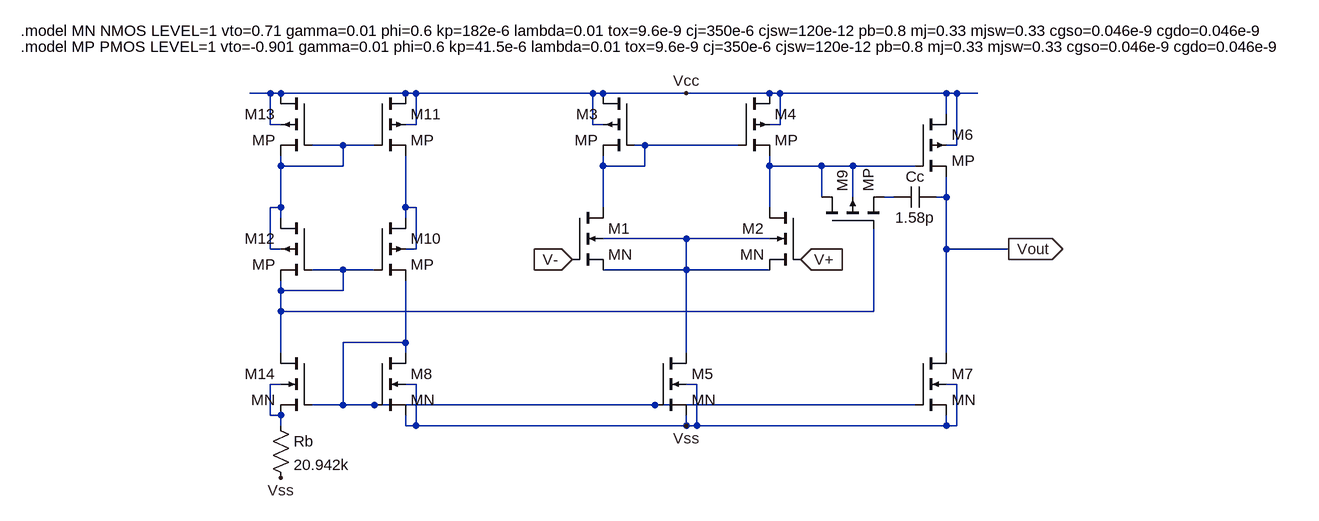
[diagram p0: schematic opamp.asc]
opamp.asc, the LTspice schematic file:
Version 4
SHEET 1 1196 680
WIRE -416 -48 -448 -48
WIRE -400 -48 -416 -48
WIRE -208 -48 -400 -48
WIRE -192 -48 -208 -48
WIRE 80 -48 -192 -48
WIRE 96 -48 80 -48
WIRE 224 -48 96 -48
WIRE 352 -48 224 -48
WIRE 368 -48 352 -48
WIRE 624 -48 368 -48
WIRE 640 -48 624 -48
WIRE 672 -48 640 -48
WIRE 624 -16 624 -48
WIRE -416 0 -416 -48
WIRE -400 0 -416 0
WIRE -192 0 -192 -48
WIRE -192 0 -208 0
WIRE 80 0 80 -48
WIRE 96 0 80 0
WIRE 368 0 368 -48
WIRE 368 0 352 0
WIRE -304 32 -352 32
WIRE -256 32 -304 32
WIRE 160 32 144 32
WIRE 304 32 160 32
WIRE 640 32 640 -48
WIRE 640 32 624 32
WIRE -400 64 -400 48
WIRE -304 64 -304 32
WIRE -304 64 -400 64
WIRE 96 64 96 48
WIRE 160 64 160 32
WIRE 160 64 96 64
WIRE 352 64 352 48
WIRE 432 64 352 64
WIRE 480 64 432 64
WIRE 576 64 480 64
WIRE 432 112 432 64
WIRE 480 112 480 64
WIRE 544 112 528 112
WIRE 624 112 624 80
WIRE 624 112 608 112
WIRE -400 128 -400 64
WIRE -400 128 -416 128
WIRE -208 128 -208 48
WIRE -192 128 -208 128
WIRE 96 128 96 64
WIRE 352 128 352 64
WIRE -400 144 -400 128
WIRE -208 144 -208 128
WIRE 224 176 96 176
WIRE 352 176 224 176
WIRE -416 192 -416 128
WIRE -400 192 -416 192
WIRE -192 192 -192 128
WIRE -192 192 -208 192
WIRE 624 192 624 112
WIRE 720 192 624 192
WIRE -304 224 -352 224
WIRE -256 224 -304 224
WIRE 224 224 224 176
WIRE 224 224 96 224
WIRE 352 224 224 224
WIRE -400 256 -400 240
WIRE -304 256 -304 224
WIRE -304 256 -400 256
WIRE -400 288 -400 256
WIRE 512 288 512 160
WIRE 512 288 -400 288
WIRE -208 336 -208 240
WIRE -208 336 -304 336
WIRE -400 352 -400 288
WIRE -208 352 -208 336
WIRE 224 352 224 224
WIRE 624 352 624 192
WIRE -400 400 -416 400
WIRE -192 400 -208 400
WIRE 240 400 224 400
WIRE 640 400 624 400
WIRE -304 432 -304 336
WIRE -304 432 -352 432
WIRE -256 432 -304 432
WIRE 176 432 -256 432
WIRE 576 432 176 432
WIRE -416 448 -416 400
WIRE -400 448 -416 448
WIRE -400 464 -400 448
WIRE -208 464 -208 448
WIRE -192 464 -192 400
WIRE -192 464 -208 464
WIRE 224 464 224 448
WIRE 224 464 -192 464
WIRE 240 464 240 400
WIRE 240 464 224 464
WIRE 624 464 624 448
WIRE 624 464 240 464
WIRE 640 464 640 400
WIRE 640 464 624 464
FLAG 48 208 V-
IOPIN 48 208 In
FLAG 400 208 V+
IOPIN 400 208 In
FLAG 224 -48 Vcc
FLAG 720 192 Vout
IOPIN 720 192 Out
FLAG 224 464 Vss
FLAG -400 544 Vss
SYMBOL nmos4 48 128 R0
SYMATTR InstName M1
SYMATTR Value MN
SYMATTR Value2 l=1u w=1.7u
SYMBOL nmos4 400 128 M0
SYMATTR InstName M2
SYMATTR Value MN
SYMATTR Value2 l=1u w=1.7u
SYMBOL pmos4 144 -48 M0
SYMATTR InstName M3
SYMATTR Value MP
SYMATTR Value2 l=1u w=2.115u
SYMBOL pmos4 304 -48 R0
SYMATTR InstName M4
SYMATTR Value MP
SYMATTR Value2 l=1u w=2.115u
SYMBOL nmos4 176 352 R0
SYMATTR InstName M5
SYMATTR Value MN
SYMATTR Value2 l=1u w=0.793u
SYMBOL pmos4 576 -16 R0
SYMATTR InstName M6
SYMATTR Value MP
SYMATTR Value2 l=4.786u w=84.319u
SYMBOL nmos4 576 352 R0
SYMATTR InstName M7
SYMATTR Value MN
SYMATTR Value2 l=1u w=3.3u
SYMBOL nmos4 -256 352 R0
SYMATTR InstName M8
SYMATTR Value MN
SYMATTR Value2 l=1u w=0.793u
SYMBOL cap 608 96 R90
WINDOW 0 0 32 VBottom 2
WINDOW 3 32 32 VTop 2
SYMATTR InstName Cc
SYMATTR Value 1.58p
SYMBOL pmos4 -256 144 R0
SYMATTR InstName M10
SYMATTR Value MP
SYMATTR Value2 l=1u w=4.23u
SYMBOL pmos4 -256 -48 R0
SYMATTR InstName M11
SYMATTR Value MP
SYMATTR Value2 l=1u w=4.23u
SYMBOL pmos4 -352 144 M0
SYMATTR InstName M12
SYMATTR Value MP
SYMATTR Value2 l=1u w=4.23u
SYMBOL pmos4 -352 -48 M0
SYMATTR InstName M13
SYMATTR Value MP
SYMATTR Value2 l=1u w=4.23u
SYMBOL nmos4 -352 352 M0
SYMATTR InstName M14
SYMATTR Value MN
SYMATTR Value2 l=1u w=3.172u
SYMBOL res -416 448 R0
SYMATTR InstName Rb
SYMATTR Value 20.942k
SYMBOL pmos4 432 160 R270
SYMATTR InstName M9
SYMATTR Value MP
SYMATTR Value2 l=1u w=4.23u
TEXT -800 -144 Left 2 !.model MN NMOS LEVEL=1 vto=0.71 gamma=0.01 phi=0.6 kp=182e-6 lambda=0.01 tox=9.6e-9 cj=350e-6 cjsw=120e-12 pb=0.8 mj=0.33 mjsw=0.33 cgso=0.046e-9 cgdo=0.046e-9
TEXT -800 -120 Left 2 !.model MP PMOS LEVEL=1 vto=-0.901 gamma=0.01 phi=0.6 kp=41.5e-6 lambda=0.01 tox=9.6e-9 cj=350e-6 cjsw=120e-12 pb=0.8 mj=0.33 mjsw=0.33 cgso=0.046e-9 cgdo=0.046e-9

The netlist it stands for:
* opamp.asc
M1 N002 V- N006 N006 MN l=1u w=1.7u
M2 N003 V+ N006 N006 MN l=1u w=1.7u
M3 Vcc N002 N002 Vcc MP l=1u w=2.115u
M4 Vcc N002 N003 Vcc MP l=1u w=2.115u
M5 N006 N008 Vss Vss MN l=1u w=0.793u
M6 Vcc N003 Vout Vcc MP l=4.786u w=84.319u
M7 Vout N008 Vss Vss MN l=1u w=3.3u
M8 N008 N008 Vss Vss MN l=1u w=0.793u
Cc Vout N004 1.58p
M10 N005 N007 N008 N005 MP l=1u w=4.23u
M11 Vcc N001 N005 Vcc MP l=1u w=4.23u
M12 N001 N007 N007 N001 MP l=1u w=4.23u
M13 Vcc N001 N001 Vcc MP l=1u w=4.23u
M14 N007 N008 N009 N009 MN l=1u w=3.172u
Rb N009 Vss 20.942k
M9 N003 N007 N004 N003 MP l=1u w=4.23u
.model NMOS NMOS
.model PMOS PMOS
.lib standard.mos
.model MN NMOS LEVEL=1 vto=0.71 gamma=0.01 phi=0.6 kp=182e-6 lambda=0.01 tox=9.6e-9 cj=350e-6 cjsw=120e-12 pb=0.8 mj=0.33 mjsw=0.33 cgso=0.046e-9 cgdo=0.046e-9
.model MP PMOS LEVEL=1 vto=-0.901 gamma=0.01 phi=0.6 kp=41.5e-6 lambda=0.01 tox=9.6e-9 cj=350e-6 cjsw=120e-12 pb=0.8 mj=0.33 mjsw=0.33 cgso=0.046e-9 cgdo=0.046e-9
.backanno
.end